# Altium schematic sheet PL2303A.SchDoc
size A4
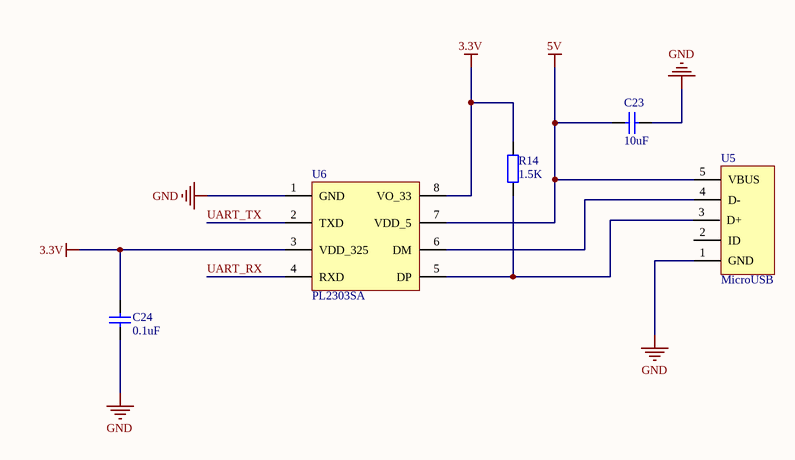
[diagram p0: PL2303A.SchDoc]

## Parts
C23  10uF  [0603]
C24  0.1uF  [0603]
R14  1.5K  [0603]
U5  MicroUSB  [Micro-USB]
U6  PL2303SA  [SOP-8]

## Nets
3.3V: C24.2 R14.2 U6.3(VDD_325) U6.8(VO_33)
5V: C23.2 U5.5(VBUS) U6.7(VDD_5)
GND: C23.1 C24.1 U5.1(GND) U6.1(GND)
UART_RX: U6.4(RXD)
UART_TX: U6.2(TXD)
NetR14_1: R14.1 U5.3(D+) U6.5(DP)
NetU5_4: U5.4(D-) U6.6(DM)

Not connected (* = marked no-connect by the designer): U5 2(ID)

## Library data of the parts
C23 C24 = Cap1: ceramic
R14 = Res
U5 = MicroUSB_B